# EAGLE design Mojo (EAGLE 9.2.2)
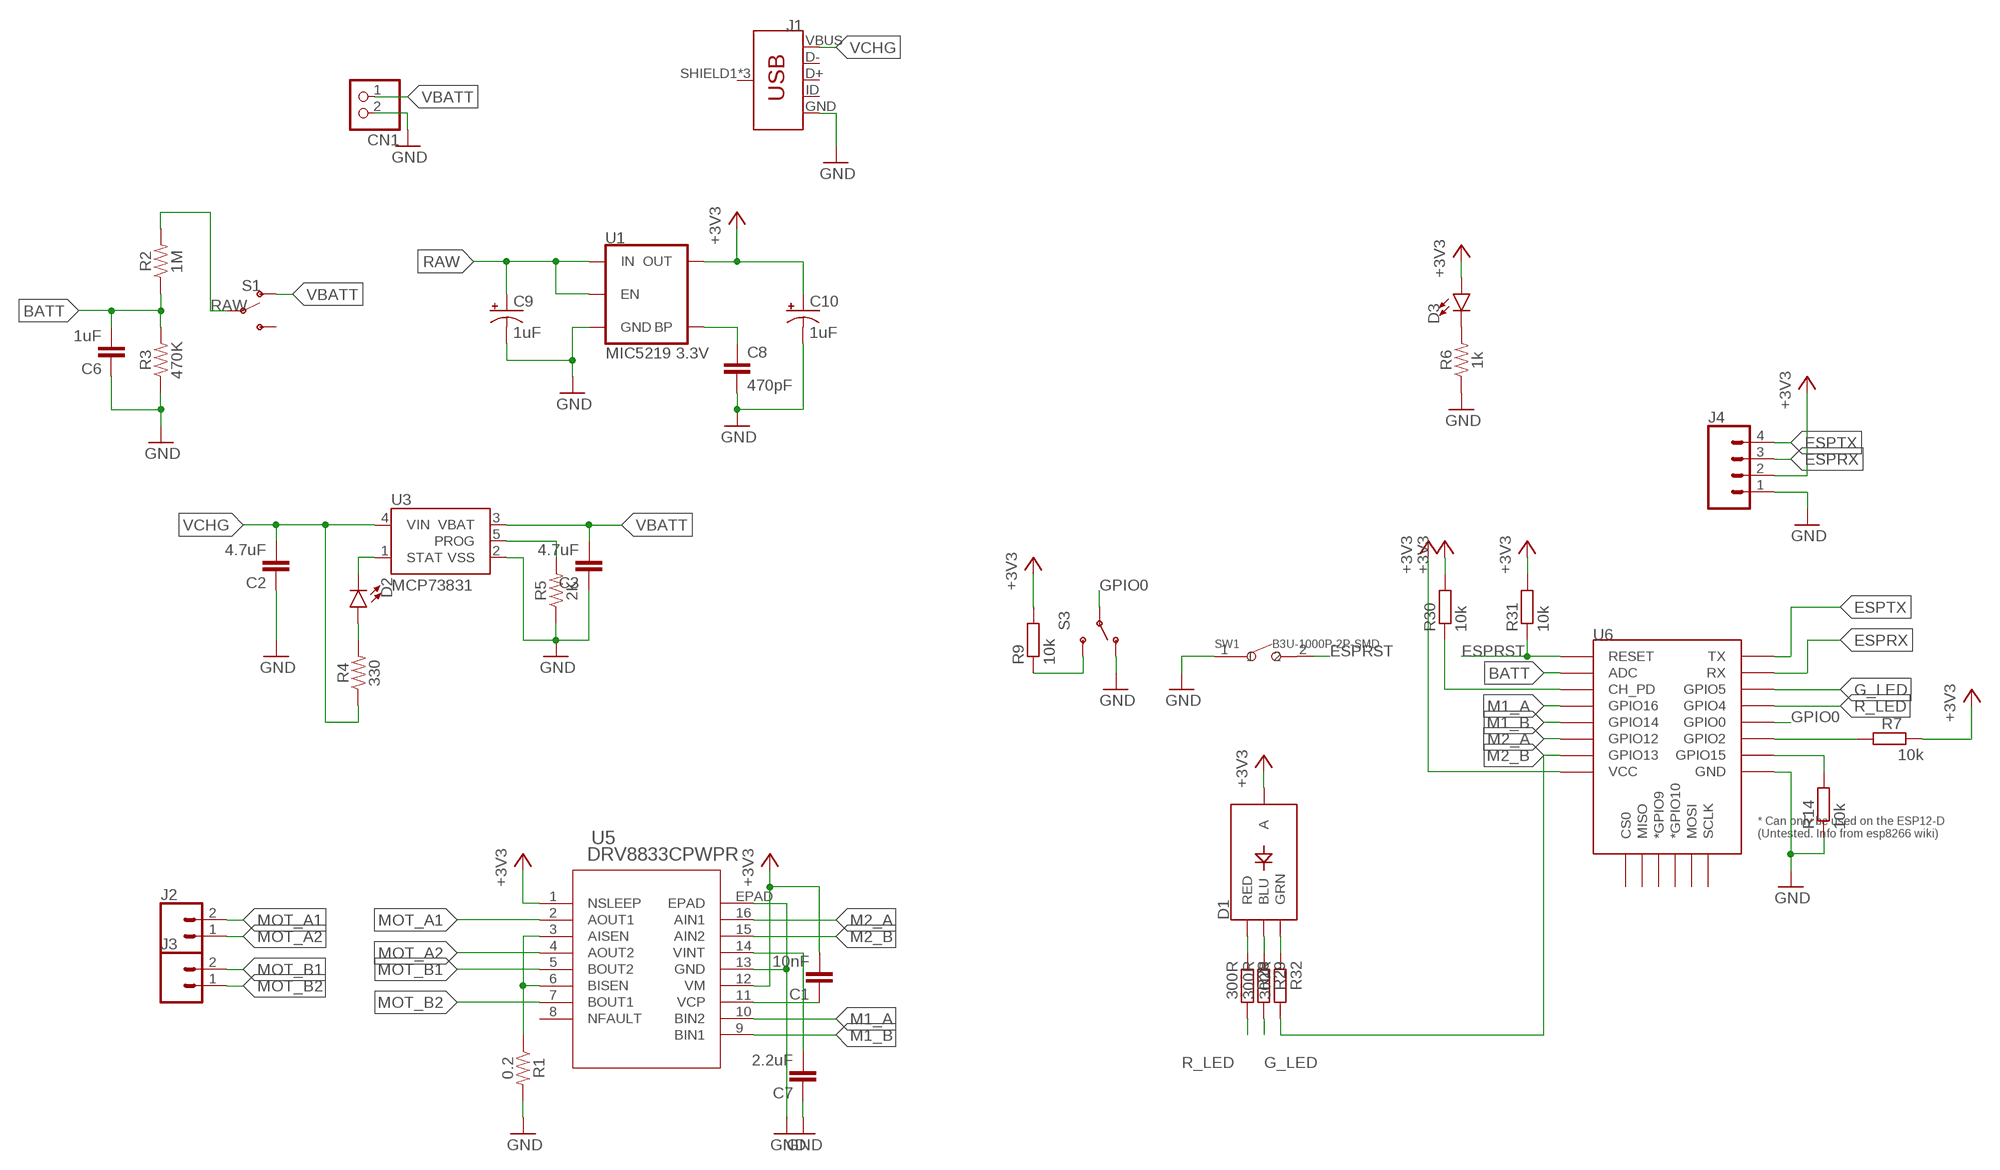
[diagram p0: schematic, sheet 1]

## Parts
C1  10nF  C-EUC0603  [C0603]
C2  4.7uF  C-EUC0603  [C0603]
C3  4.7uF  C-EUC0603  [C0603]
C6  1uF  C-EUC0603  [C0603]
C7  2.2uF  C-EUC0603  [C0603]
C8  470pF  470PF-0603-50V-5%  [0603]
C9  1uF  10UF-POLAR-EIA3216-16V-10%(TANT)  [EIA3216]
C10  1uF  10UF-POLAR-EIA3216-16V-10%(TANT)  [EIA3216]
CN1  JST_2PIN-THM-RA  [JST-PH-2-THM-RA]
D1  LED-RGB-CASMD  [LED-TRICOLOR-SMD]
D2  LED0603  [LED-0603]
D3  LED0603  [LED-0603]
J1  USB_MICRO-BREDUCED_PASTE  [USB-B-MICRO-SMD_RED_PASTE]
J2  CONN_02  [1X02]
J3  CONN_02  [1X02]
J4  CONN_04  [1X04]
R1  0.2  RESISTOR0603  [0603]
R2  1M  RESISTOR0603  [0603]
R3  470K  RESISTOR0603  [0603]
R4  330  RESISTOR0603  [0603]
R5  2K  RESISTOR0603  [0603]
R6  1k  RESISTOR0603  [0603]
R7  10k  R-EU_R0603  [R0603]
R9  10k  R-EU_R0603  [R0603]
R14  10k  R-EU_R0603  [R0603]
R28  300R  R-EU_R0603  [R0603]
R29  300R  R-EU_R0603  [R0603]
R30  10k  R-EU_R0603  [R0603]
R31  10k  R-EU_R0603  [R0603]
R32  300R  R-EU_R0603  [R0603]
S1  SWITCH-SPDT-SMD-RIGHT-ANGLE  [SWITCH_SPST_SMD_A]
S3  SWITCH-SPDT-SMD-A  [SWITCH-SPST-SMD-A]
SW1  B3U-1000P-2P-SMD  SMD-BUTTON(2P-3.0X2.5X1.2+0.4MM)-B3U-1000P-2P-SMD  [SW2-2.6-3.0X2.5X1.2+0.4MM]
U1  MIC5219 3.3V  V_REG_MIC52193.3V  [SOT23-5]
U3  MCP73831  [SOT23-5]
U5  DRV8833CPWPR  [PWP16_2P31X2P46]
U6  ESP12ESMD  [ESP12E-SMD]

## Nets
+3V3: C1.2 C10.+ D1.A D3.A J4.2 R7.2 R9.2 R30.2 R31.2 U1.5(OUT) U5.1(NSLEEP) U5.12(VM) U6.VCC
BATT: C6.2 R2.1 R3.2 U6.ADC
ESPRST: R31.1 SW1.2 U6.RESET
ESPRX: J4.3 U6.RXD0(RX)
ESPTX: J4.4 U6.TXD0(TX)
G_LED: R29.2 U6.GPIO5
GND: C2.1 C3.1 C6.1 C7.1 C8.2 C9.- C10.- CN1.2 J1.GND J4.1 R1.2 R3.1 R5.1 R6.1 R14.1 S3.1(O) SW1.1 U1.2(GND) U3.2(VSS) U5.13(GND) U5.EPAD U6.GND
GPIO0: S3.2(P) U6.GPIO0
M1_A: U5.10(BIN2) U6.GPIO16
M1_B: U5.9(BIN1) U6.GPIO14
M2_A: U5.16(AIN1) U6.GPIO12
M2_B: R32.2 U5.15(AIN2) U6.GPIO13
MOT_A1: J2.2 U5.2(AOUT1)
MOT_A2: J2.1 U5.4(AOUT2)
MOT_B1: J3.2 U5.5(BOUT2)
MOT_B2: J3.1 U5.7(BOUT1)
N$1: R9.1 S3.3(S)
N$3: D3.C R6.2
N$4: D2.C U3.1(STAT)
N$5: D2.A R4.2
N$6: C8.1 U1.4(BP)
N$9: R5.2 U3.5(PROG)
N$11: R1.1 U5.3(AISEN) U5.6(BISEN)
N$14: C7.2 U5.14(VINT)
N$15: C1.1 U5.11(VCP)
N$52: R30.1 U6.CH_PD
N$60: D1.R(RED) R28.1
N$61: D1.B(BLU) R29.1
N$62: D1.G(GRN) R32.1
N$84: R14.2 U6.GPIO15
R_LED: R28.2 U6.GPIO4
RAW: C9.+ R2.2 S1.2(P) U1.1(IN) U1.3(EN)
SDAESP: R7.1 U6.GPIO2
VBATT: C3.2 CN1.1 S1.1(O) U3.3(VBAT)
VCHG: C2.2 J1.VBUS R4.1 U3.4(VIN)
Unconnected: J1.D+ J1.D- J1.ID J1.SHIELD1(SHIELD) J1.SHIELD2(SHIELD) J1.SHIELD3(SHIELD) S1.3(S) U5.8(NFAULT) U6.CS0 U6.GPIO9(*GPIO9) U6.GPIO10(*GPIO10) U6.MISO U6.MOSI U6.SCLK

## Library data of the parts
C1-C3 C6 C7 = resistor:C-EU: CAPACITOR, European symbol
C8 = SparkFun-Capacitors:470PF: 470pF ceramic capacitors A capacitor is a passive two-terminal electrical component used to store electrical energy temporarily in an electric field.; PROD_ID: CAP-07884
C9 C10 = SparkFun-Capacitors:10UF-POLAR: 10.0µF polarized capacitors A capacitor is a passive two-terminal electrical component used to store electrical energy temporarily in an electric field.; PROD_ID: CAP-00811; VALUE: 10uF
CN1 = adafruit:JST_2PIN: JST 2-Pin Connectors of various flavors SMT-RA (S2B-PH-SM4) 4UConnector #17311 SMT (B2B-PH-SM4) THM-RA (S2B-PH) THM (B2B-PH)
D1 = SparkFun-LED:LED-RGB-CA: LED-RGB Diffused Common Anode Packages: LED RGB-THRU P-LCC-4-3 LED-TRICOLOR-SMD SparkFun Products: RGB Diffused Common Anode- Diffuse <[https://www.sparkfun.com/products/10821]> RGB Diffused Common Anode - Clear <[https://www.sparkfun.com/products/10820]> Qduino Mini <[https://www.sparkfun.com/products/13614]> Triple Output LED RGB - SMD <https://www.sparkfun.com/products/7844>; PROD_ID: DIO-08324
D2 D3 = SparkFun-LED:LED: LED (Generic) Standard schematic elements and footprints for 5mm, 3mm, 1206, and 0603 sized LEDs. Generic LEDs with no color specified.
J1 = SparkFun-Connectors:USB_MICRO-B: USB Type Micro-B Connector Male/female and PTH/SMT variants SparkFun Products: SparkFun microB USB Breakout <https://www.sparkfun.com/products/12035> SparkFun USB microB Plug Breakout <https://www.sparkfun.com/products/10031> SparkFun ESP8266 Thing <https://www.sparkfun.com/products/13231>; PROD_ID: CONN-11752
J2 J3 = SparkFun-Connectors:CONN_02: Multi connection point. Often used as Generic Header-pin footprint for 0.1 inch spaced/style header connections On any of the 0.1 inch spaced packages, you can populate with these: Break Away Headers - Straight <https://www.sparkfun.com/products/116> (PRT-00116) Break Away Male Headers - Right Angle <https://www.sparkfun.com/products/553> (PRT-00553) Female Headers <https://www.sparkfun.com/products/115> (PRT-00115) Break Away Headers - Machine Pin <https://www.sparkfun.com/products/117> (PRT-00117) Break Away Female Headers - Swiss Machine Pin <https://www.sparkfun.com/products/743> (PRT-00743) For SCREWTERMINALS and SPRING TERMINALS visit here: Screw Terimnals on SparkFun.com <https://www.sparkfun.com/search/results?term=Screw+Terminals> (5mm/3.5mm/2.54mm spacing) This device is also useful as a general connection point to wire up your design to another part of your project. Our various solder wires solder well into these plated through hole pads. Hook-Up Wire - Assortment (Stranded, 22 AWG) <https://www.sparkfun.com/products/11375> (PRT-11375) Hook-Up Wire - Assortment (Solid Core, 22 AWG) <https://www.sparkfun.com/products/11367> (PRT-11367) View the entire wire category on our website here <https://www.sparkfun.com/categories/141> Special notes: Molex polarized connector foot print use with: PRT-08233 with associated crimp pins and housings. 2.54_SCREWTERM for use with PRT-10571. 3.5mm Screw Terminal footprints for PRT-08084 5mm Screw Terminal footprints for use with PRT-08432
J4 = SparkFun-Connectors:CONN_04: Multi connection point. Often used as Generic Header-pin footprint for 0.1 inch spaced/style header connections On any of the 0.1 inch spaced packages, you can populate with these: Break Away Headers - Straight <https://www.sparkfun.com/products/116> (PRT-00116) Break Away Male Headers - Right Angle <https://www.sparkfun.com/products/553> (PRT-00553) Female Headers <https://www.sparkfun.com/products/115> (PRT-00115) Break Away Headers - Machine Pin <https://www.sparkfun.com/products/117> (PRT-00117) Break Away Female Headers - Swiss Machine Pin <https://www.sparkfun.com/products/743> (PRT-00743) For SCREWTERMINALS and SPRING TERMINALS visit here: Screw Terimnals on SparkFun.com <https://www.sparkfun.com/search/results?term=Screw+Terminals> (5mm/3.5mm/2.54mm spacing) This device is also useful as a general connection point to wire up your design to another part of your project. Our various solder wires solder well into these plated through hole pads. Hook-Up Wire - Assortment (Stranded, 22 AWG) <https://www.sparkfun.com/products/11375> (PRT-11375) Hook-Up Wire - Assortment (Solid Core, 22 AWG) <https://www.sparkfun.com/products/11367> (PRT-11367) View the entire wire category on our website here <https://www.sparkfun.com/categories/141> Special notes: Molex polarized connector foot print use with SKU : PRT-08231 with associated crimp pins and housings. 1MM SMD Version SKU: PRT-10208; PROD_ID: CONN-09696
R1-R6 = SparkFun-Resistors:RESISTOR: Generic Resistor Package
R7 R9 R14 R28-R32 = resistor:R-EU_: RESISTOR, European symbol
S1 = SparkFun-Switches:SWITCH-SPDT: Single Pole, Double Throw (SPDT) Switch Single-pole, double-throw (SPDT) switch. Variant Overview SMD-AYZ0202 Surface Mount DPDT Switch <https://www.sparkfun.com/products/597> (COM-00597) Used on e.g. LilyPad Arduino USB - ATmega32U4 Board <https://www.sparkfun.com/products/12049> PTH-11.6X4.0MM SPDT Mini Power Switch <https://www.sparkfun.com/products/102> (COM-00102) Used on e.g. SparkFun Simon Says - Through-Hole Soldering Kit <https://www.sparkfun.com/products/10547> (KIT-10547) PTH-11.6X4.0MM-KIT KIT version of SPDT Mini Power Switch - Simplifies soldering by removing tStop of switch pins - only one side can be soldered. PTH-11.6X4.0MM-LOCK LOCK version of SPDT Mini Power Switch - Offset pins hold switch in place for easier soldering. SMD-RIGHT-ANGLE Surface Mount Right Angle Switch <https://www.sparkfun.com/products/10860> (COM-10860) Used on e.g. SparkFun ESP8266 Thing <https://www.sparkfun.com/products/13231>; PROD_ID: SWCH-10651; SF_SKU: COM-10860
S3 = SparkFun-Electromechanical:SWITCH-SPDT: SPDT Switch Simple slide switch, Spark Fun Electronics SKU : COM-00102 DPDT SMT slide switch, AYZ0202, SWCH-08179; PROD_ID: SWCH-10651
SW1 = Seeed-Switch:SMD-BUTTON(2P-3.0X2.5X1.2+0.4MM): 311020047; MPN: B3U-1000P-2P-SMD
U1 = SparkFun-IC-Power:V_REG_MIC5219: V_REG MIC5219 Standard 3.3V and 5V 500mA LDO voltage regulator in SOT-23 layout. Micrel part MIC5219. BP (by-pass) pin is used to lower output noise with 470pF cap, may be left open.; PROD_ID: VREG-09872
U3 = SparkFun-IC-Power:MCP73831: MCP73831T Li-Ion, Li-Pol Controller Miniature single cell, fully integrated Li-Ion, Li-polymer charge management controller Datasheet <http://ww1.microchip.com/downloads/en/DeviceDoc/20001984g.pdf> SparkFun Products: SparkFun ESP32 Thing <https://www.sparkfun.com/products/13907> SparkFun 9DoF Razor IMU M0 <https://www.sparkfun.com/products/14001>; PROD_ID: IC-09995
U5 = thesis:DRV8833CPWPR; MANUFACTURER_PART_NUMBER: DRV8833CPWPR; VENDOR: Texas Instruments
U6 = esp8266modules:ESP12E: ESP12E Module

## Board
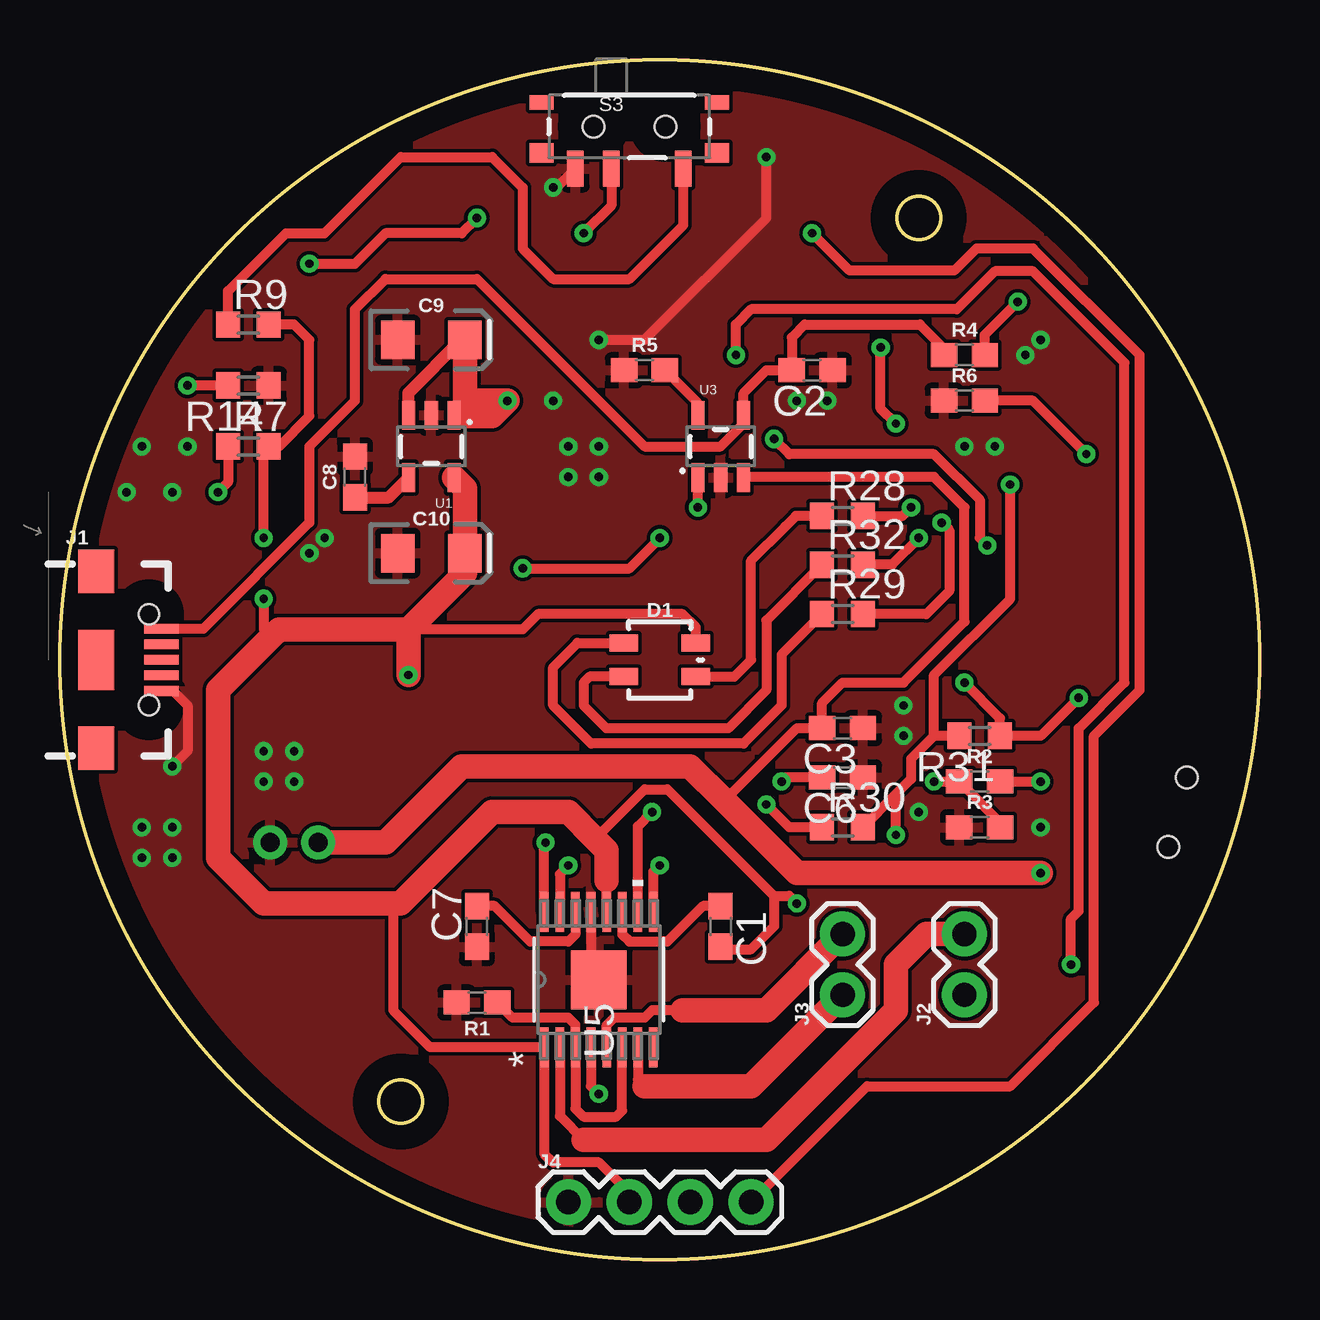
[diagram p1: board, top side]
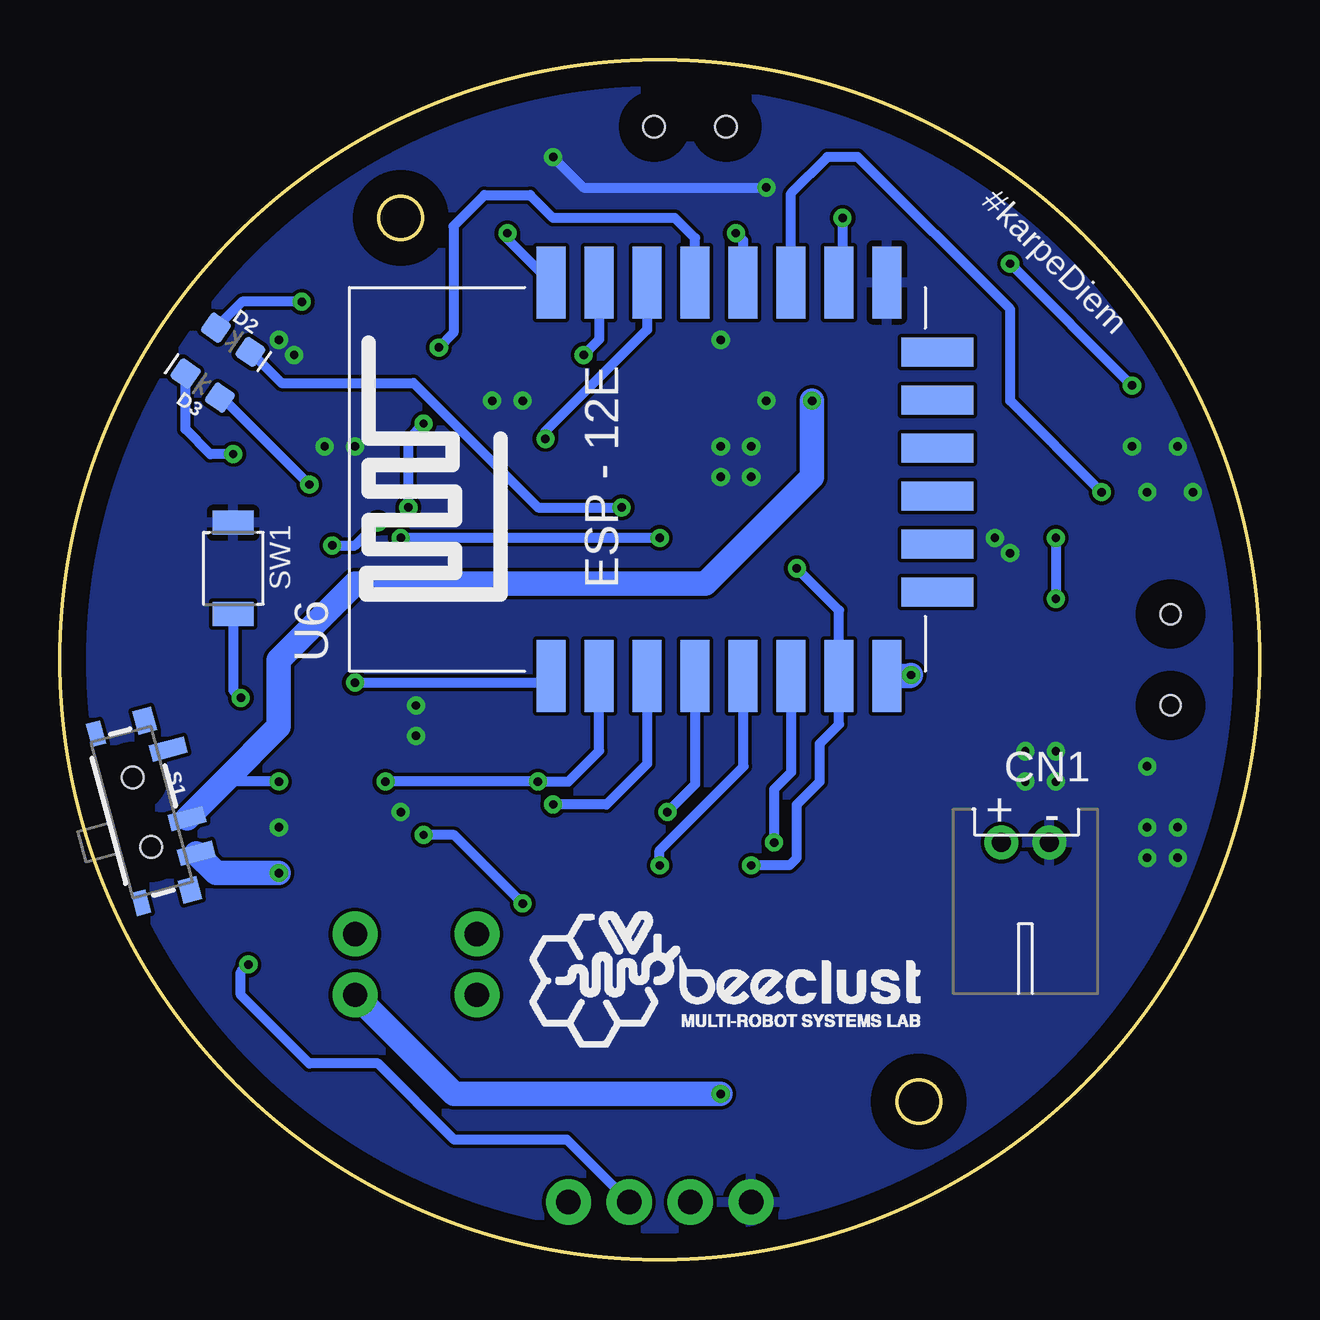
[diagram p2: board, bottom side, seen from below]

Size 50 x 50 mm. Coordinates in mm from the lower left corner, seen from the top.
Outline: circle at 25,25 radius 25
Outline: circle at 14.21,6.59 radius 0.9
Outline: circle at 35.8,43.41 radius 0.9
Copper layers (1*16): Top 0.035mm / dielectric 1.5mm / Bottom 0.035mm
Design rules "default": minimum track width 6mil, minimum drill 0.35mm, track to track 6mil, track to pad 6mil, pad to pad 6mil, via to via 6mil, smd to smd 6mil, copper to edge 40mil, drill to drill 6mil, minimum pad ring 10mil, minimum via ring 8mil, stop-mask expansion 4mil, vias tented up to drill 0mil, thermal gap 10mil

### Footprints (pad centres in the part's own frame; a part is rotated, then mirrored left to right if it is on the bottom)
C0603 = smd 1.1 x 1: 1 -0.85,0; 2 0.85,0
0603 = smd 1.1 x 1: 1 -0.85,0; 2 0.85,0
EIA3216 = smd 1.4 x 1.6: + 1.4,0; - -1.4,0
JST-PH-2-THM-RA = drill 0.8 pad 1.422: 1 1,0; 2 -1,0
LED-TRICOLOR-SMD = smd 1.2 x 0.7: A 1.5,0.7; B -1.5,0.7; G -1.5,-0.7; R 1.5,-0.7
LED-0603 = smd 1 x 1: A -0.877,0; C 0.877,0
USB-B-MICRO-SMD_RED_PASTE = smd 1.45 x 0.4: D+ 2.725,0; D- 2.725,0.65; GND 2.725,-1.3; ID 2.725,-0.65; VBUS 2.725,1.3 | smd 1.5 x 1.8: SHIELD1 0,3.685; SHIELD2 0,-3.685 | smd 1.5 x 2.5: SHIELD3 0,0 | hole 0.85: 2.2,1.9; 2.2,-1.9
1X02 = drill 1.016 pad 1.88: 1 0,0; 2 2.54,0
1X04 = drill 1.016 pad 1.88: 1 0,0; 2 2.54,0; 3 5.08,0; 4 7.62,0
R0603 = smd 1 x 1.1: 1 -0.85,0; 2 0.85,0
SWITCH_SPST_SMD_A = smd 0.7 x 1.5: 1 -2.25,-1.75; 2 -0.75,-1.75; 3 2.25,-1.75 | smd 1 x 0.6: GND1 -3.65,1; GND3 3.65,1 | smd 1 x 0.8: GND2 -3.65,-1.1; GND4 3.65,-1.1 | hole 0.9: -1.5,0; 1.5,0
SWITCH-SPST-SMD-A = smd 0.7 x 1.5: 1 -2.25,-1.75; 2 -0.75,-1.75; 3 2.25,-1.75 | smd 1 x 0.6: GND1 -3.65,1; GND3 3.65,1 | smd 1 x 0.8: GND2 -3.65,-1.1; GND4 3.65,-1.1 | hole 0.9: -1.5,0; 1.5,0
SW2-2.6-3.0X2.5X1.2+0.4MM = smd 1 x 1.7: 1 -1.9,0; 2 1.9,0
SOT23-5 = smd 0.55 x 1.2: 1 -0.95,-1.3; 2 0,-1.3; 3 0.95,-1.3; 4 0.95,1.3; 5 -0.95,1.3
PWP16_2P31X2P46 = smd 1.676 x 0.356: 1 -2.819,2.275; 2 -2.819,1.625; 3 -2.819,0.975; 4 -2.819,0.325; 5 -2.819,-0.325; 6 -2.819,-0.975; 7 -2.819,-1.625; 8 -2.819,-2.275; 9 2.819,-2.275; 10 2.819,-1.625; 11 2.819,-0.975; 12 2.819,-0.325; 13 2.819,0.325; 14 2.819,0.975; 15 2.819,1.625; 16 2.819,2.275 | smd 2.46 x 2.31: EPAD 0,0
ESP12E-SMD = smd 3 x 1.2: ADC -8.3,3.8; CH_PD -8.3,1.8; GND 8.1,-8.2; GPIO0 8.1,-2.2; GPIO2 8.1,-4.2; GPIO4 8.1,-0.2; GPIO5 8.1,1.8; GPIO12 -8.3,-4.2; GPIO13 -8.3,-6.2; GPIO14 -8.3,-2.2; GPIO15 8.1,-6.2; GPIO16 -8.3,-0.2; RESET -8.3,5.8; RXD0 8.1,3.8; TXD0 8.1,5.8; VCC -8.3,-8.2 | smd 1.2 x 3: CS0 -4.8,-10.3; GPIO9 -0.8,-10.3; GPIO10 1.2,-10.3; MISO -2.8,-10.3; MOSI 3.2,-10.3; SCLK 5.2,-10.3

### Placement (x,y rotation side)
C1  27.54,13.89 270 top
C2  31.35,37.07 180 top
C3  32.62,22.16 180 top
C6  32.62,20.1 180 top
C7  17.38,13.89 90 top
C8  12.3,32.62 90 top
C9  15.48,38.34 0 top
C10  15.48,29.45 0 top
CN1  9.76,17.38 180 bottom
D1  25,25 0 top
D2  42.78,38.34 325 bottom
D3  44.05,36.43 145 bottom
J1  1.51,25 0 top
J2  37.7,11.03 90 top
J3  32.62,11.03 90 top
J4  21.19,2.39 0 top
R1  17.38,10.71 180 top
R2  38.34,19.92 0 top
R3  38.34,18.02 0 top
R4  37.7,37.7 0 top
R5  24.37,37.07 0 top
R6  37.7,35.8 0 top
R7  7.86,33.89 0 top
R9  7.86,38.97 0 top
R14  7.86,36.43 180 top
R28  32.62,30.99 0 top
R29  32.62,26.91 0 top
R30  32.62,18.02 0 top
R31  38.34,21.83 180 top
R32  32.62,28.96 0 top
S1  46.59,18.65 105 bottom
S3  23.73,47.23 0 top
SW1  42.78,28.81 270 bottom
U1  15.48,33.89 180 top
U3  27.54,33.89 0 top
U5  22.46,11.67 90 top
U6  23.73,32.62 90 bottom
U$1  [LOGO-M]  30.71,8.49 0 bottom

### Tracks (layer width: path | path; a pad name or v marks a point on that pad's centre or on a via)
+3V3  (via drill 0.35)
  Top 0.406: U5.12 22.79,15.8 | R31.2 36.43,21.83 | 36.43,21.83 35.48,20.87 35.48,20.02 34.79,19.34 | 34.79,19.34 R30.2 | 14.21,14.84 13.89,14.52 13.89,10.4 15.44,8.85 U5.1 20.19,4.42 20.55,4.05 22.46,4.05 23.73,2.78 J4.2 | 22.3,17.54 24.37,19.6 25.32,19.6 29.76,15.16 | 29.76,15.16 29.76,13.89 28.81,12.94 27.64,12.94 C1.2 | 29.76,15.16 30.4,15.16 v30.71,14.84 | v34.84,17.7 34.84,19.29 34.79,19.34 | 36.43,21.83 36.43,24.37 39.61,27.54 v39.61,32.3 | D1.A 26.5,26.36 25.95,26.91 19.92,26.91 19.29,26.27 14.52,26.27 | v8.49,27.54 8.49,26.27 8.81,25.95 | v8.49,30.08 8.49,33.68 R7.2 9.13,33.89 10.4,35.16 10.4,38.34 9.76,38.97 R9.2
  Top 1.016: 22.79,15.8 22.78,15.81 22.78,17.06 22.3,17.54 21.19,18.65 18.02,18.65 14.21,14.84 8.49,14.84 6.59,16.75 6.59,23.73 8.81,25.95 9.13,26.27 14.52,26.27 | v14.52,24.37 14.52,26.27 | 14.52,26.27 16.88,28.62 C10.+ 16.88,32.14 U1.5
  Bottom 0.406: v30.71,14.84 33.57,17.7 v34.84,17.7 | v39.61,32.3 43.23,35.93 D3.A | v8.49,30.08 v8.49,27.54
  Bottom 1.016: U6.VCC 14.57,24.32 v14.52,24.37
BATT  (via drill 0.35)
  Top 0.406: C6.2 30.26,20.1 v30.08,19.92 | R3.2 39.19,18.22 R2.1 v36.43,19.92
  Bottom 0.406: U6.ADC 27.53,21.2 28.81,19.92 29.45,19.92 v30.08,19.92 v36.43,19.92
ESPRST  (via drill 0.35)
  Top 0.406: v42.46,23.41 40.88,21.83 R31.1 39.19,22.56 v37.7,24.05
  Bottom 0.406: SW1.2 42.78,23.73 v42.46,23.41 | v37.7,24.05 29.8,24.05 U6.RESET
ESPRX  (via drill 0.35)
  Top 0.406: v42.14,12.3 42.14,14.21 42.46,14.52 42.46,22.14 44.37,24.05 44.37,37.38 40.56,41.19 38.97,41.19 37.38,39.61 28.81,39.61 28.18,38.97 v28.18,37.7
  Bottom 0.406: J4.3 28.87,5 33.57,5 36.75,8.17 39.61,8.17 42.46,11.03 42.46,11.98 v42.14,12.3 | U6.RXD0 27.53,38.34 v28.18,37.7
ESPTX  (via drill 0.35)
  Top 0.406: J4.4 33.64,7.22 39.61,7.22 43.1,10.71 43.1,21.83 45,23.73 45,37.7 40.56,42.15 38.2,42.15 37.28,41.22 32.91,41.22 v31.35,42.78
  Bottom 0.406: U6.TXD0 31.35,42.54 v31.35,42.78
G_LED  (via drill 0.35)
  Top 0.406: v29.76,34.21 30.4,33.57 36.43,33.57 38.34,31.67 38.34,30.08 v38.65,29.76 | v36.75,30.71 37.06,30.4 37.06,27.86 36.11,26.91 R29.2
  Bottom 0.406: v29.76,34.21 29.76,34.52 25.53,38.76 U6.GPIO5 | v38.65,29.76 37.7,29.76 v36.75,30.71
GND  (via drill 0.35)
  Top 0.406: J1.GND 4.71,23.7 5.32,23.1 5.32,21.19 v4.68,20.55 | U5.13 22.14,11.99 U5.EPAD | S3.1 20.69,44.69 v20.55,44.69 | v22.46,38.34 24.37,38.34 29.45,43.41 v29.45,45.95
  Bottom 0.406: v20.55,44.69 28.18,44.69 v29.45,45.95
  other vias: 3.41,33.89 5.32,33.89 4.68,31.98 2.78,31.98 21.19,33.89 22.46,33.89 22.46,32.62 21.19,32.62 20.55,35.8 30.71,35.8 31.98,35.8 37.7,33.89 38.97,33.89 40.24,37.7 40.88,38.34 10.4,29.45 11.03,30.08 8.49,21.19 9.76,21.19 9.76,19.92 8.49,19.92 3.41,18.02 4.68,18.02 3.41,16.75 4.68,16.75 35.8,18.65 40.88,18.02 35.16,21.83 35.16,23.1
  pour Top: -0.4,-0.4 50.4,-0.4 50.4,50.4 -0.4,50.4
  pour Bottom: -0.4,-0.4 54.21,-0.4 54.21,50.4 -0.4,50.4
GPIO0  (via drill 0.35)
  Top 0.406: S3.2 22.98,43.94 v21.82,42.78
  Bottom 0.406: v21.82,42.78 21.53,42.48 U6.GPIO0
M1_A  (via drill 0.35)
  Top 0.406: U5.10 24.09,18.05 v24.68,18.65
  Bottom 0.406: U6.GPIO16 23.53,19.8 v24.68,18.65
M1_B  (via drill 0.35)
  Top 0.406: U5.9 24.73,16.16 v25,16.43
  Bottom 0.406: v25,16.43 25,17.06 21.51,20.55 21.51,24.3 U6.GPIO14
M2_A  (via drill 0.35)
  Top 0.406: U5.16 20.19,17.33 v20.24,17.38
  Bottom 0.406: U6.GPIO12 19.53,20.31 20.24,19.6 v20.24,17.38
M2_B  (via drill 0.35)
  Top 0.406: v21.19,16.43 20.84,16.07 U5.15 | v19.29,28.81 23.73,28.81 v25,30.08 | v35.8,30.08 34.68,28.96 R32.2
  Bottom 0.406: v21.19,16.43 19.6,16.43 19.29,16.75 19.29,18.97 18.33,19.92 18.33,21.51 17.53,22.31 U6.GPIO13 17.53,27.05 v19.29,28.81 | v25,30.08 v35.8,30.08
MOT_A1
  Top 0.406: U5.2 20.84,5.99 21.82,5
  Top 1.016: 21.82,5 29.45,5 34.84,10.4 34.84,12.3 36.11,13.57 J2.2
MOT_A2  (via drill 0.35)
  Top 0.406: U5.4 22.14,7.23 v22.46,6.9
  Bottom 1.016: J2.1 33.57,6.9 v22.46,6.9
MOT_B1
  Top 0.406: U5.5 22.79,9.77 23.1,10.08 24.37,10.08 24.68,10.4 25.95,10.4
  Top 1.016: 25.95,10.4 29.45,10.4 J3.2
MOT_B2
  Top 0.406: U5.7 24.09,7.5 24.37,7.22
  Top 1.016: 24.37,7.22 28.81,7.22 J3.1
N$1
  Top 0.406: R9.1 7.01,40.37 9.42,42.78 11.03,42.78 14.21,45.95 18.02,45.95 19.29,44.69 19.29,42.15 20.55,40.88 23.73,40.88 25.98,43.12 S3.3
N$3  (via drill 0.35)
  Top 0.406: v42.78,33.57 40.56,35.8 R6.2
  Bottom 0.406: v42.78,33.57 43.73,33.57 44.77,34.61 D3.C
N$4  (via drill 0.35)
  Top 0.406: v26.59,31.35 U3.1
  Bottom 0.406: D2.C 40.77,36.54 35.27,36.54 30.08,31.35 v26.59,31.35
N$5  (via drill 0.35)
  Top 0.406: v39.92,39.92 38.55,38.55 R4.2
  Bottom 0.406: v39.92,39.92 42.41,39.92 D2.A
N$6
  Top 0.508: C8.1 13.71,31.77 U1.4
N$9
  Top 0.406: U3.5 26.59,35.69 R5.2
N$11
  Top 0.406: R1.1 18.87,10.08 21.19,10.08 21.48,9.78 U5.3 21.48,6.29 21.82,5.95 23.18,5.95 23.44,6.21 U5.6
N$14
  Top 0.406: U5.14 21.48,13.55 21.19,13.25 19.6,13.25 18.12,14.74 C7.2
N$15
  Top 0.406: U5.11 23.44,13.55 23.73,13.25 25,13.25 25.32,13.25 26.8,14.74 C1.1
N$52  (via drill 0.35)
  Top 0.406: R30.1 30.4,18.02 v29.45,18.97
  Bottom 0.406: v29.45,18.97 27.22,18.97 25.53,20.66 U6.CH_PD
N$60
  Top 0.406: D1.R 28.11,24.3 28.81,25 28.81,29.13 30.24,30.56 30.4,30.71 30.68,30.99 R28.1
N$61
  Top 0.406: R29.1 30.08,25.21 30.08,23.1 28.49,21.51 22.14,21.51 20.55,23.1 20.55,24.68 21.57,25.7 D1.B
N$62
  Top 0.406: D1.G 22.08,24.3 21.82,24.05 21.82,23.1 22.78,22.14 27.86,22.14 29.45,23.73 29.45,26.64 R32.1
N$84  (via drill 0.35)
  Top 0.406: R14.2 v5.32,36.43 | v10.4,41.51 12.3,41.51 13.57,42.78 16.75,42.78 v17.38,43.41
  Bottom 0.406: v17.38,43.41 17.38,40.87 U6.GPIO15 | v5.32,36.43 v10.4,41.51
R_LED  (via drill 0.35)
  Top 0.406: v34.84,34.84 34.21,35.48 v34.21,38.02 | R28.2 35.12,30.99 v35.48,31.35
  Bottom 0.406: v35.48,31.35 35.48,34.21 v34.84,34.84 | U6.GPIO4 23.53,42.58 24.37,43.41 29.45,43.41 30.4,44.37 32.3,44.37 33.6,43.07 33.6,38.62 v34.21,38.02
RAW  (via drill 0.35)
  Top 0.406: R2.2 v40.88,19.92
  Top 0.508: U1.1 16.72,35.19 16.75,35.16 | U1.3 14.53,36.12 16.75,38.34 C9.+
  Top 1.016: C9.+ 16.88,35.8 v18.65,35.8 18.02,35.16 16.75,35.16
  Bottom 0.406: 43.13,19.95 40.91,19.95 v40.88,19.92
  Bottom 1.016: S1.2 43.13,19.95 40.88,22.21 40.88,25 37.7,28.18 23.1,28.18 18.65,32.62 v18.65,35.8
SDAESP  (via drill 0.35)
  Top 0.406: R7.1 7.01,32.41 v6.59,31.98
  Bottom 0.406: U6.GPIO2 19.53,44.44 18.02,45.95 16.75,45.95 10.4,39.61 10.4,35.8 v6.59,31.98
VBATT  (via drill 0.35)
  Top 0.406: U3.3 28.52,32.62 36.43,32.62 37.7,31.35 37.7,26.59 35.16,24.05 32.62,24.05 31.77,23.2 C3.2 30.73,22.16 27.7,19.13
  Top 1.016: CN1.1 13.57,17.38 16.75,20.55 26.27,20.55 27.7,19.13 30.71,16.11 v40.88,16.11
  Bottom 1.016: v40.88,16.11 43.5,16.11 S1.1
VCHG
  Top 0.406: J1.VBUS 5.98,26.3 10.4,30.71 10.4,33.89 12.3,35.8 12.3,39.61 13.57,40.88 17.38,40.88 24.37,33.89 27.54,33.89 28.49,34.84 U3.4 28.49,36.11 29.45,37.07 C2.2 30.5,38.44 31.03,38.97 35.85,38.97 36.85,37.97 R4.1

### Text on the board
bPlace: #karpeDiem